# EasyEDA Pro project pcb.epro

# Schematic Schematic1
Board Name: Board1; Create Date: 2026-04-12; Page Name: P1; Project Name: sdadapt; Schematic Name: Schematic1; Update Date: 2026-04-12; Company: EasyEDA.com; Page Size: A4; Version: V1.0
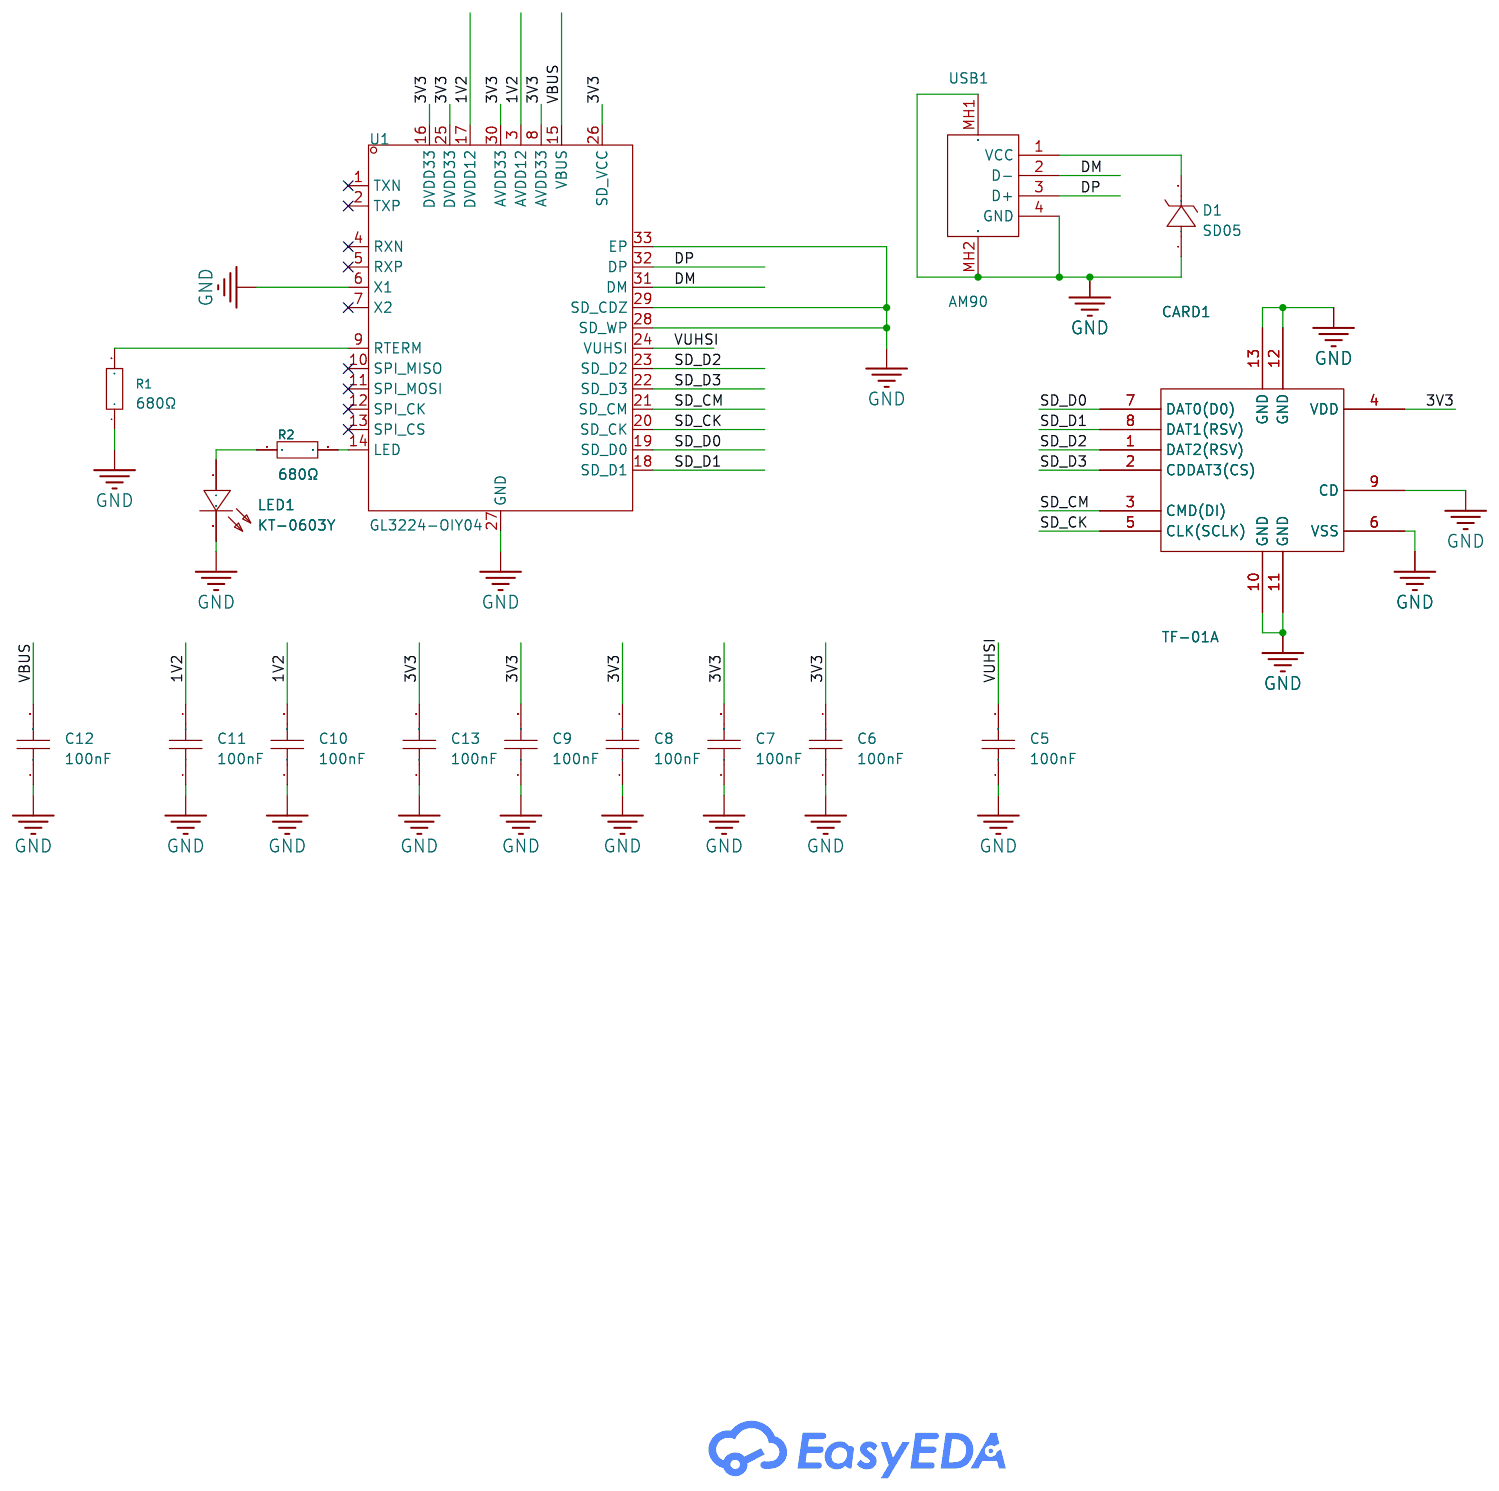
[diagram p0: schematic sheet]

## Parts
C5  100nF  [C0402]
C6  100nF  [C0402]
C7  100nF  [C0402]
C8  100nF  [C0402]
C9  100nF  [C0402]
C10  100nF  [C0402]
C11  100nF  [C0402]
C12  100nF  [C0402]
C13  100nF  [C0402]
CARD1  TF-01A  [TF-SMD_TF-01A]
D1  SD05  [SOD-323_L1.8-W1.3-LS2.5-FD]
LED1  KT-0603Y  [LED0603-R-RD]
R1  680Ω  [R0603]
R2  680Ω  [R0603]
U1  GL3224-OIY04  [HQFN-32_L5.0-W5.0-P0.50-BL-EP3.0]
USB1  AM90  [USB-AM-TH_AM90]

## Library data of the parts
C5-C13 = CL05B104KO5NNNC: Capacitance:100nF Tolerance:±10% Tolerance:±10% Voltage Rating:16V Temperature Coefficient:X7R; LCSC Part Name: 100nF ±10% 16V; Supplier Part: C1525; Manufacturer: SAMSUNG(三星); Supplier Footprint: 0402; JLCPCB Part Class: Basic Part; Datasheet: https://item.szlcsc.com/datasheet/CL05B104KO5NNNC/1877.html; Supplier: LCSC; Tolerance: ±10%; Voltage Rating: 16V; Temperature Coefficient: X7R
CARD1 = TF-01A_C91145: Card Connection Mode:Push-Push Card Type:MicroSD Card (TF Card) Connector Type:Connector and Ejector Additional Card Detection Pins:- Supplementary Features:With Locating Post Height Above Board:1.85mm Operating Temperature:- Operating Temperature:-; LCSC Part Name: 自弹式 MicroSD卡(TF卡) 卡座; Supplier Part: C91145; Manufacturer: 韩国韩荣; Supplier Footprint: SMD; JLCPCB Part Class: Extended Part; Datasheet: https://item.szlcsc.com/datasheet/TF-01A/92334.html; Supplier: LCSC; Card Connection Mode: Push-Push; Card Type: MicroSD Card (TF Card); Connector Type: Connector and Ejector; Supplementary Features: With Locating Post; Height Above Board: 1.85mm
D1 = SD05_C502527: Polarity:Unidirectional Reverse Stand-Off Voltage (Vrwm):5V Clamping Voltage:18V Peak Pulse Current (Ipp):17A Peak Pulse Power Dissipation (Ppp):350W Voltage - Breakdown:6V Reverse Leakage Current (Ir):1uA Number of Channels:1 Operating Temperature:-55℃~+; LCSC Part Name: 单向TVS 5V截止 峰值脉冲电流：17A; Supplier Part: C502527; Manufacturer: MDD(辰达半导体); Supplier Footprint: SOD-323; JLCPCB Part Class: Extended Part; Datasheet: https://item.szlcsc.com/datasheet/SD05/515033.html; Supplier: LCSC; Polarity: Unidirectional; Reverse Stand-Off Voltage (Vrwm): 5V; Clamping Voltage: 18V; Peak Pulse Current (Ipp): 17A; Peak Pulse Power Dissipation (Ppp): 350W; Voltage - Breakdown: 6V; Reverse Leakage Current (Ir): 1uA; Number of Channels: 1; Operating Temperature: -55℃~+125℃; level of protection: IEC 61000-4-2；IEC 61000-4-4; Type: TVS; Junction Capacitance: 10pF
LED1 = KT-0603Y: Illumination Color:Yellow Voltage - Forward(Vf):2.4V Voltage - Forward(Vf):2.4V Power(Watts):40mW Wavelength - Dominant:584nm~594nm Wavelength - Dominant:584nm~594nm Peak Wavelength:596nm Lens Color:Water Clear Luminous Intensity:175mcd Luminous Intensity; LCSC Part Name: 0603 黄灯 高亮; Supplier Part: C2287; Manufacturer: KENTO; Supplier Footprint: 0603; JLCPCB Part Class: Extended Part; Datasheet: https://item.szlcsc.com/datasheet/KT-0603Y/2660.html; Supplier: LCSC; Illumination Color: Yellow; Voltage - Forward(Vf): 2.4V; Power(Watts): 40mW; Wavelength - Dominant: 584nm~594nm; Peak Wavelength: 596nm; Lens Color: Water Clear; Luminous Intensity: 175mcd; Viewing Angle: 120°; Operating Temperature: -40℃~+85℃
R1 R2 = 0603WAF6800T5E: Type:Thick Film Resistors Resistance: Tolerance:±1% Tolerance:±1% Power(Watts): Overload Voltage (Max): Temperature Coefficient:±100ppm/℃ Temperature Coefficient:±100ppm/℃ Operating Temperature Range:-55℃~+155℃ Operating Temperature Range:-55℃~+155℃; LCSC Part Name: 680Ω ±1% 100mW 厚膜电阻; Supplier Part: C23228; Manufacturer: UNI-ROYAL(厚声); Supplier Footprint: 0603; JLCPCB Part Class: Basic Part; Datasheet: https://atta.szlcsc.com/upload/public/pdf/source/20200306/C422600_1E6D84923E4A46A82E41ADD87F860B5C.pdf; Supplier: LCSC; Type: Thick Film Resistors; Tolerance: ±1%; Temperature Coefficient: ±100ppm/℃; Operating Temperature Range: -55℃~+155℃
U1 = GL3224-OIY04: Applications Function:USB to SD/MMC USB Protocol:USB 3.1；USB 2.0 Number of Channels:2 Voltage - Supply:4.75V~5.25V Voltage - Supply:4.75V~5.25V Data Rate:5Gbps Operating Temperature:0℃~+70℃ Operating Temperature:0℃~+70℃ Current - Supply:120mA Quiescent Su; LCSC Part Name: USB 3.1 Gen 1 双/单逻辑单元号（LUN）存储卡读取器控制器; Supplier Part: C157357; Manufacturer: GENESYS(创惟); Supplier Footprint: QFN-32-EP(5x5); JLCPCB Part Class: Extended Part; Datasheet: https://item.szlcsc.com/datasheet/GL3224-OIY04/168702.html; Supplier: LCSC; Applications Function: USB to SD/MMC; USB Protocol: USB 3.1；USB 2.0; Number of Channels: 2; Voltage - Supply: 4.75V~5.25V; Data Rate: 5Gbps; Operating Temperature: 0℃~+70℃; Current - Supply: 120mA; Quiescent Supply Current: 850uA
USB1 = AM90: Connector Type:Type-A Protocol Standard:USB 2.0 Gender:Male Mounting Type:Right Angle Number of Contacts:4P Number of Ports:1 Current Rating-Power:1.5A Voltage Rating:30V Connect-Disconnect Life:5,000 times Supplementary Features:- Center Height:- Length:; LCSC Part Name: Type-A弯插公头; Supplier Part: C404965; Manufacturer: SHOU HAN(首韩); Supplier Footprint: 弯插; JLCPCB Part Class: Extended Part; Datasheet: https://item.szlcsc.com/datasheet/AM90/392530.html; Supplier: LCSC; Connector Type: Type-A; Protocol Standard: USB 2.0; Gender: Male; Mounting Type: Right Angle; Number of Contacts: 4P; Number of Ports: 1; Current Rating-Power: 1.5A; Voltage Rating: 30V; Connect-Disconnect Life: 5,000 times; Length: 18.8mm; Detection color: White; Operating Temperature: -25℃~+85℃

## Nets
1V2: C10.2 C11.2 U1.3(AVDD12) U1.17(DVDD12)
3V3: C6.2 C7.2 C8.2 C9.2 C13.2 CARD1.4(VDD) U1.8(AVDD33) U1.16(DVDD33) U1.25(DVDD33) U1.26(SD_VCC) U1.30(AVDD33)
GND: C5.1 C6.1 C7.1 C8.1 C9.1 C10.1 C11.1 C12.1 C13.1 CARD1.6(VSS) CARD1.9(CD) CARD1.10(GND) CARD1.11(GND) CARD1.12(GND) CARD1.13(GND) D1.1(A) LED1.2(K) R1.1 U1.6(X1) U1.27(GND) U1.28(SD_WP) U1.29(SD_CDZ) U1.33(EP) USB1.4(GND) USB1.MH1 USB1.MH2
VBUS: C12.2 U1.15(VBUS)
DM: U1.31(DM) USB1.2(D-)
DP: U1.32(DP) USB1.3(D+)
SD_CK: CARD1.5(CLK(SCLK)) U1.20(SD_CK)
SD_CM: CARD1.3(CMD(DI)) U1.21(SD_CM)
SD_D0: CARD1.7(DAT0(D0)) U1.19(SD_D0)
SD_D1: CARD1.8(DAT1(RSV)) U1.18(SD_D1)
SD_D2: CARD1.1(DAT2(RSV)) U1.23(SD_D2)
SD_D3: CARD1.2(CDDAT3(CS)) U1.22(SD_D3)
VUHSI: C5.2 U1.24(VUHSI)
$1N1300: D1.2(K) USB1.1(VCC)
$1N2615: R1.2 U1.9(RTERM)
$1N2744: R2.2 U1.14(LED)
$1N2863: LED1.1(A) R2.1

Not connected (* = marked no-connect by the designer): U1 1(TXN)* 2(TXP)* 4(RXN)* 5(RXP)* 7(X2)* 10(SPI_MISO)* 11(SPI_MOSI)* 12(SPI_CK)* 13(SPI_CS)*

# Board PCB1
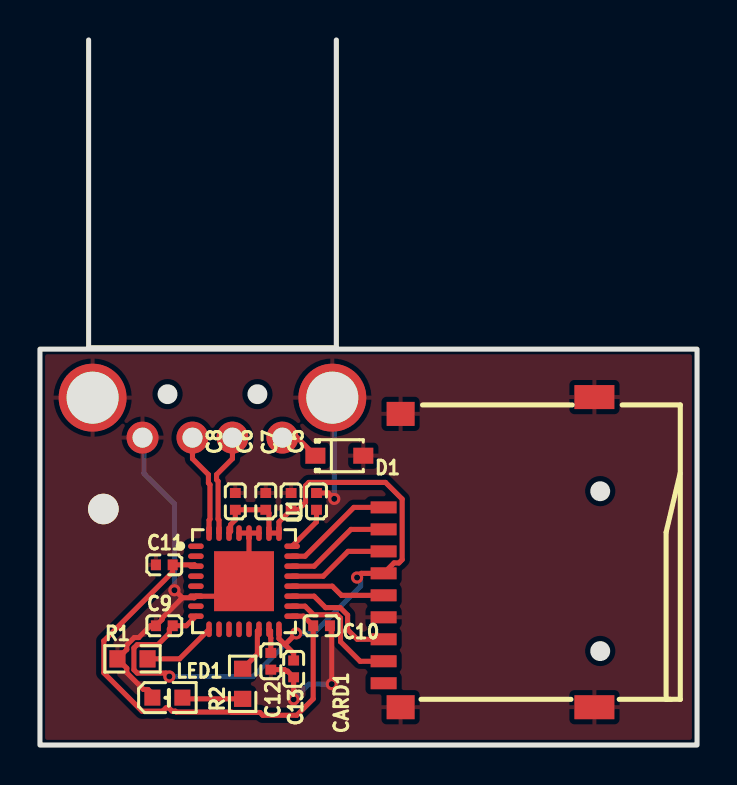
[diagram p1: board, top side]
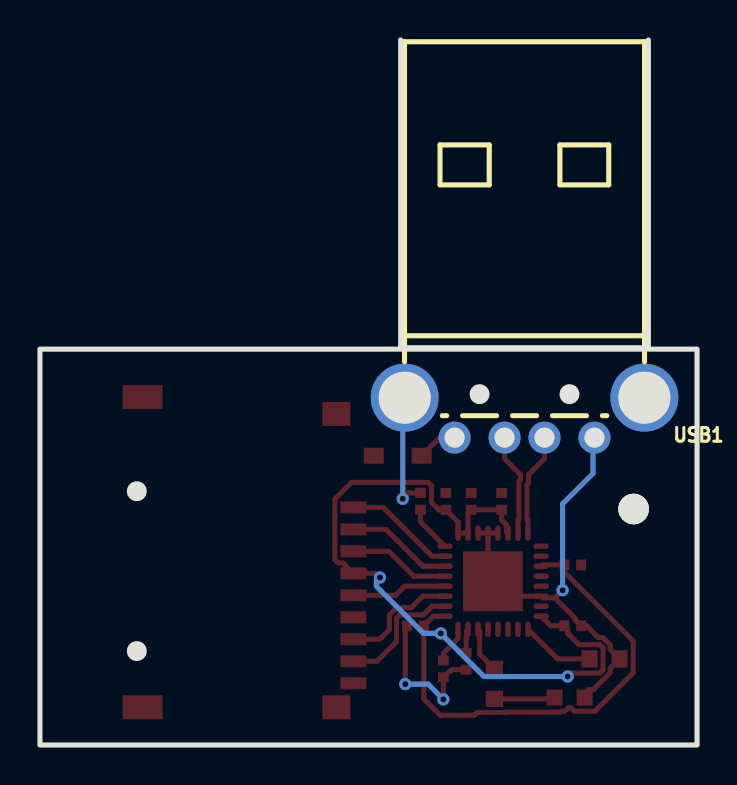
[diagram p2: board, bottom side, seen from below]

Outline 32.89 x 35.28 mm; copper layers: Top Layer, Bottom Layer. Coordinates in mm from the lower left corner of the outline.
Outline path: rectangle 0,19.81 32.89,0
Stack: Top Layer 0.035mm / Dielectric1 1.51mm FR4 er 4.5 / Bottom Layer 0.035mm

## Design rules (mm)
net DM: DP1
net DP: DP1
template: JLCPCB Capability(Two Layers Board)
spacing copperThickness1oz (default): track to track 0.102, other pairs 0.152 to 0.3
spacing copperThickness2oz: track to track 0.203, other pairs 0.152 to 0.3
track width copperThickness1oz (default): min 0.127, default 0.254, max 2.54
track width copperThickness2oz: min 0.203, default 0.254, max 2.54
differential pair differentialPair (default): width min 0.127, default 0.254, max 2.54; gap min 0.152, default 0.152
via viaSize (default): diameter min 0.5, default 0.61, max 10; hole min 0.3, default 0.305, max 6.3

## Placement (name value [footprint] x y rotation side)
C5  100nF  [C0402]  13.84 12.19 270 top
C6  100nF  [C0402]  11.3 12.19 270 top
C7  100nF  [C0402]  12.57 12.19 270 top
C8  100nF  [C0402]  9.78 12.19 270 top
C9  100nF  [C0402]  6.22 5.97 0 top
C10  100nF  [C0402]  14.1 5.97 180 top
C11  100nF  [C0402]  6.22 9.02 0 top
C12  100nF  [C0402]  11.56 4.19 90 top
C13  100nF  [C0402]  12.7 3.81 90 top
CARD1  TF-01A  [TF-SMD_TF-01A]  22.48 9.65 90 top
D1  SD05  [SOD-323_L1.8-W1.3-LS2.5-FD]  14.99 14.48 180 top
LED1  KT-0603Y  [LED0603-R-RD]  6.38 2.37 0 top
NOREF  -  [Pad_e34]  3.17 11.81 0 top
R1  680Ω  [R0603]  4.63 4.31 0 top
R2  680Ω  [R0603]  10.15 3.06 90 top
U1  GL3224-OIY04  [HQFN-32_L5.0-W5.0-P0.50-BL-EP3.0]  10.21 8.2 270 top
USB1  AM90  [USB-AM-TH_AM90]  8.64 16.38 0 bottom

## Footprints (pads in the part's own frame, mm; a bottom-side part is the same pattern mirrored in y, then rotated)
C0402
  rect 0.5x0.54 smd: 1(-0.42,0) 2(0.42,0)
HQFN-32_L5.0-W5.0-P0.50-BL-EP3.0
  oval 0.28x0.785 smd: 1(-1.75,-2.408) 2(-1.25,-2.408) 3(-0.75,-2.408) 4(-0.25,-2.408) 5(0.25,-2.408) 6(0.75,-2.408) 7(1.25,-2.408) 8(1.75,-2.408) 17(1.75,2.408) 18(1.25,2.408) 19(0.75,2.408) 20(0.25,2.408) 21(-0.25,2.408) 22(-0.75,2.408) 23(-1.25,2.408) 24(-1.75,2.408)
  oval 0.785x0.28 smd: 9(2.408,-1.75) 10(2.408,-1.25) 11(2.408,-0.75) 12(2.408,-0.25) 13(2.408,0.25) 14(2.408,0.75) 15(2.408,1.25) 16(2.408,1.75) 25(-2.408,1.75) 26(-2.408,1.25) 27(-2.408,0.75) 28(-2.408,0.25) 29(-2.408,-0.25) 30(-2.408,-0.75) 31(-2.408,-1.25) 32(-2.408,-1.75)
  rect 3x3 smd: 33(0,0)
LED0603-R-RD
  rect 0.8x0.8 smd: 1(0.751,0) 2(-0.751,0)
Pad_e34
  round 1.524 hole 34x3.4: 1(0,0)
R0603
  rect 0.806x0.864 smd: 1(-0.753,0) 2(0.753,0)
SOD-323_L1.8-W1.3-LS2.5-FD
  rect 1x0.8 smd: 1(-1.2,0) 2(1.2,0)
TF-SMD_TF-01A
  rect 0.6x1.3 smd: 1(2.24,5.276) 2(1.14,5.276) 3(0.04,5.276) 4(-1.06,5.276) 5(-2.16,5.276) 6(-3.26,5.276) 7(-4.36,5.276) 8(-5.46,5.276) 9(-6.56,5.276)
  rect 1.2x1.4 smd: 10(-7.76,4.426) 13(6.92,4.426)
  rect 1.2x2 smd: 11(-7.76,-5.276) 12(7.76,-5.276)
USB-AM-TH_AM90
  round 1.6 hole 1: 1(3.5,1) 2(1,1) 3(-1,1) 4(-3.5,1)
  round 3.4 hole 2.6: MH1(6,-1) MH2(-6,-1)

## Nets
As in the schematic, except:
GND: C5.1 C6.1 C7.1 C8.1 C9.1 C10.1 C11.1 C12.1 C13.1 CARD1.6 CARD1.10 CARD1.11 CARD1.12 CARD1.13 D1.1 LED1.2 NOREF.1 R1.1 U1.6 U1.27 U1.28 U1.29 U1.33 USB1.4 USB1.MH1 USB1.MH2

Pads without a net: U1 1 2 4 5 7 10 11 12 13

## Via types
v1: diameter 0.61, hole 0.305, Top Layer to Bottom Layer, 7 vias

## Routing (per net, layer and track width the routed paths; a pad name or vN(x,y) marks a point on that pad's centre or on a via; arc(x,y) is an arc through that point)
1V2: length 24.8
  Top Layer w0.254: U1.17 13.2,6.45 C10.2 13.68,2.31 12.86,1.49 11.15,1.49 11.01,1.63 9.6,1.63 9.58,1.65 6.82,1.65 6.78,1.69 6.61,1.69 6.45,1.86 6.31,1.86 6.14,1.69 5.11,1.69 3.2,3.61 3.2,5.21 6.64,8.66 C11.2 7.74,9.02 U1.3
3V3: length 40.1
  Top Layer w0.254: v1(15.88,8.38) 16.08,8.59 CARD1.4 17.72,9.11 17.97,9.11 18.13,9.28 18.13,12.31 17.3,13.14 13.46,13.14 13.29,12.98 13.29,12.14 12.93,11.77 C7.2 11.96,11.16 U1.25 U1.26 11.46,11.61 C6.2 C8.2 9.78,11.27 9.55,11.03 9.55,10.69 U1.30 ; v1(6.48,3.43) 6.3,3.6 4.87,3.6 4.7,3.77 4.7,4.86 4.87,5.02 5.9,5.02 6.48,5.6 6.48,5.8 C9.2 7.33,5.97 U1.8 ; v1(12.83,5.59) 12.26,5.02 ; 12.26,5.02 11.96,5.32 U1.16 ; 12.26,5.02 12.7,4.59 C13.2
  Bottom Layer w0.254: v1(15.88,8.38) 16.05,8.2 16.05,7.95 13.69,5.59 v1(12.83,5.59) 10.67,3.43 v1(6.48,3.43)
GND: length 37
  Top Layer w0.254: v1(14.6,3.05) 14.6,5.88 14.52,5.97 ; 7.13,7.37 7.73,7.37 U1.6 9.46,7.45 U1.33 10.21,8.41 10.46,8.66 U1.28 ; 7.13,7.37 6.75,7.75 v1(6.73,7.75) ; 7.13,7.37 6.11,6.35 6.11,6.28 C9.1 5.53,5.97 4.95,5.38 4.72,5.38 4.35,5.01 4.35,4.78 R1.1 4.35,3.84 4.35,3.62 5.19,2.78 5.41,2.78 5.63,2.56 LED1.2 ; U1.28 U1.27 ; U1.28 U1.29 ; v1(14.73,12.32) 14.44,12.61 C5.1 ; 11.56,3.77 12.24,3.77 12.31,3.7 12.39,3.7 C13.1 v1(12.7,2.29)
  Bottom Layer w0.254: v1(6.73,7.75) 6.73,12.06 5.21,13.59 5.21,15.31 USB1.4 ; v1(14.73,12.32) 14.73,17.29 USB1.MH1 ; v1(12.7,2.29) 13.46,3.05 v1(14.6,3.05)
VBUS: length 1.2
  Top Layer w0.254: C12.2 11.56,5.35 11.55,5.36 11.55,5.71 U1.15
DM: length 5.2
  Top Layer w0.254: U1.31 8.96,11.25 8.92,11.3 8.92,13.2 8.84,13.28 8.84,13.53 9.64,14.33 USB1.2
DP: length 5.2
  Top Layer w0.254: USB1.3 7.64,14.33 8.43,13.53 8.43,13.11 8.51,13.03 8.51,11.3 8.46,11.25 U1.32
SD_CK: length 4.8
  Top Layer w0.254: U1.20 14.63,7.95 15.09,7.49 CARD1.5
SD_CM: length 5.1
  Top Layer w0.254: U1.21 14.18,8.45 15.42,9.69 CARD1.3
SD_D0: length 5.9
  Top Layer w0.254: U1.19 13.72,7.45 14.3,6.87 15.03,6.87 15.4,6.5 15.4,5.77 15.88,5.29 CARD1.7
SD_D1: length 6.4
  Top Layer w0.254: CARD1.8 16.02,4.19 15.05,5.17 15.05,6.35 14.88,6.52 13.7,6.52 13.27,6.95 U1.18
SD_D2: length 5.6
  Top Layer w0.254: U1.23 13.27,9.45 15.71,11.89 CARD1.1
SD_D3: length 5.3
  Top Layer w0.254: CARD1.2 15.57,10.79 13.72,8.95 U1.22
VUHSI: length 2.3
  Top Layer w0.254: C5.2 13.84,11.17 U1.24
$1N1300: length 2
  Top Layer w0.254: USB1.1 12.88,15.38 D1.2
$1N2615: length 3.7
  Top Layer w0.254: U1.9 6.99,4.31 R1.2
$1N2744: length 2.3
  Top Layer w0.254: R2.2 10.88,4.55 10.88,5.71 U1.14
$1N2863: length 3
  Top Layer w0.254: 10.15,2.31 7.19,2.31 LED1.1

## Copper pours and planes (outline as drawn; the poured copper is in the pictures)
GND on Top Layer: 0.25,19.56 32.64,19.56 32.64,0.25 0.25,0.25
